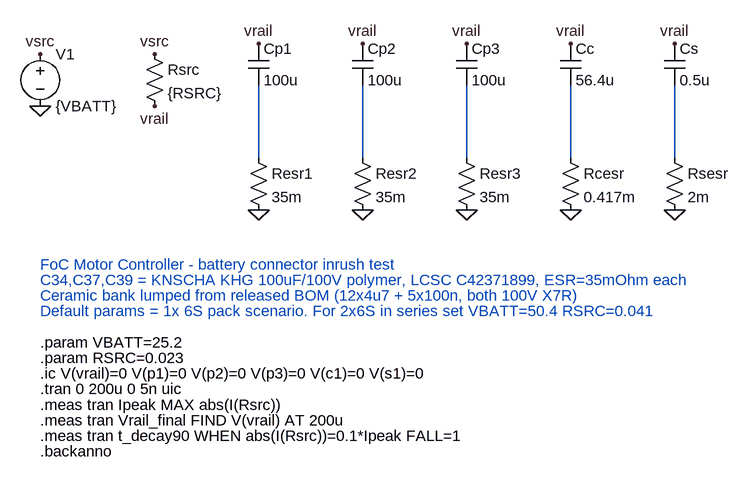
[diagram p0: schematic battery_inrush.asc]
battery_inrush.asc, the LTspice schematic file:
Version 4
SHEET 1 880 680
WIRE 336 64 336 176
WIRE 496 64 496 176
WIRE 656 64 656 176
WIRE 816 64 816 176
WIRE 976 64 976 176
FLAG 0 16 vsrc
FLAG 0 96 0
FLAG 176 16 vsrc
FLAG 176 96 vrail
FLAG 336 0 vrail
FLAG 336 256 0
FLAG 496 0 vrail
FLAG 496 256 0
FLAG 656 0 vrail
FLAG 656 256 0
FLAG 816 0 vrail
FLAG 816 256 0
FLAG 976 0 vrail
FLAG 976 256 0
SYMBOL voltage 0 0 R0
SYMATTR InstName V1
SYMATTR Value {VBATT}
SYMBOL res 160 0 R0
SYMATTR InstName Rsrc
SYMATTR Value {RSRC}
SYMBOL cap 320 0 R0
SYMATTR InstName Cp1
SYMATTR Value 100u
SYMBOL res 320 160 R0
SYMATTR InstName Resr1
SYMATTR Value 35m
SYMBOL cap 480 0 R0
SYMATTR InstName Cp2
SYMATTR Value 100u
SYMBOL res 480 160 R0
SYMATTR InstName Resr2
SYMATTR Value 35m
SYMBOL cap 640 0 R0
SYMATTR InstName Cp3
SYMATTR Value 100u
SYMBOL res 640 160 R0
SYMATTR InstName Resr3
SYMATTR Value 35m
SYMBOL cap 800 0 R0
SYMATTR InstName Cc
SYMATTR Value 56.4u
SYMBOL res 800 160 R0
SYMATTR InstName Rcesr
SYMATTR Value 0.417m
SYMBOL cap 960 0 R0
SYMATTR InstName Cs
SYMATTR Value 0.5u
SYMBOL res 960 160 R0
SYMATTR InstName Rsesr
SYMATTR Value 2m
TEXT 0 340 Left 2 ;FoC Motor Controller - battery connector inrush test
TEXT 0 364 Left 2 ;C34,C37,C39 = KNSCHA KHG 100uF/100V polymer, LCSC C42371899, ESR=35mOhm each
TEXT 0 388 Left 2 ;Ceramic bank lumped from released BOM (12x4u7 + 5x100n, both 100V X7R)
TEXT 0 412 Left 2 ;Default params = 1x 6S pack scenario. For 2x6S in series set VBATT=50.4 RSRC=0.041
TEXT 0 460 Left 2 !.param VBATT=25.2
TEXT 0 484 Left 2 !.param RSRC=0.023
TEXT 0 508 Left 2 !.ic V(vrail)=0 V(p1)=0 V(p2)=0 V(p3)=0 V(c1)=0 V(s1)=0
TEXT 0 532 Left 2 !.tran 0 200u 0 5n uic
TEXT 0 556 Left 2 !.meas tran Ipeak MAX abs(I(Rsrc))
TEXT 0 580 Left 2 !.meas tran Vrail_final FIND V(vrail) AT 200u
TEXT 0 604 Left 2 !.meas tran t_decay90 WHEN abs(I(Rsrc))=0.1*Ipeak FALL=1
TEXT 0 628 Left 2 !.backanno

The netlist it stands for:
* battery_inrush.asc
V1 vsrc 0 {VBATT}
Rsrc vsrc vrail {RSRC}
Cp1 vrail N001 100u
Resr1 N001 0 35m
Cp2 vrail N002 100u
Resr2 N002 0 35m
Cp3 vrail N003 100u
Resr3 N003 0 35m
Cc vrail N004 56.4u
Rcesr N004 0 0.417m
Cs vrail N005 0.5u
Rsesr N005 0 2m
* FoC Motor Controller - battery connector inrush test
* C34,C37,C39 = KNSCHA KHG 100uF/100V polymer, LCSC C42371899, ESR=35mOhm each
* Ceramic bank lumped from released BOM (12x4u7 + 5x100n, both 100V X7R)
* Default params = 1x 6S pack scenario. For 2x6S in series set VBATT=50.4 RSRC=0.041
.param VBATT=25.2
.param RSRC=0.023
.ic V(vrail)=0 V(p1)=0 V(p2)=0 V(p3)=0 V(c1)=0 V(s1)=0
.tran 0 200u 0 5n uic
.meas tran Ipeak MAX abs(I(Rsrc))
.meas tran Vrail_final FIND V(vrail) AT 200u
.meas tran t_decay90 WHEN abs(I(Rsrc))=0.1*Ipeak FALL=1
.backanno
.backanno
.end